# EAGLE design ws2812b-tree-test (EAGLE 8.4.0)
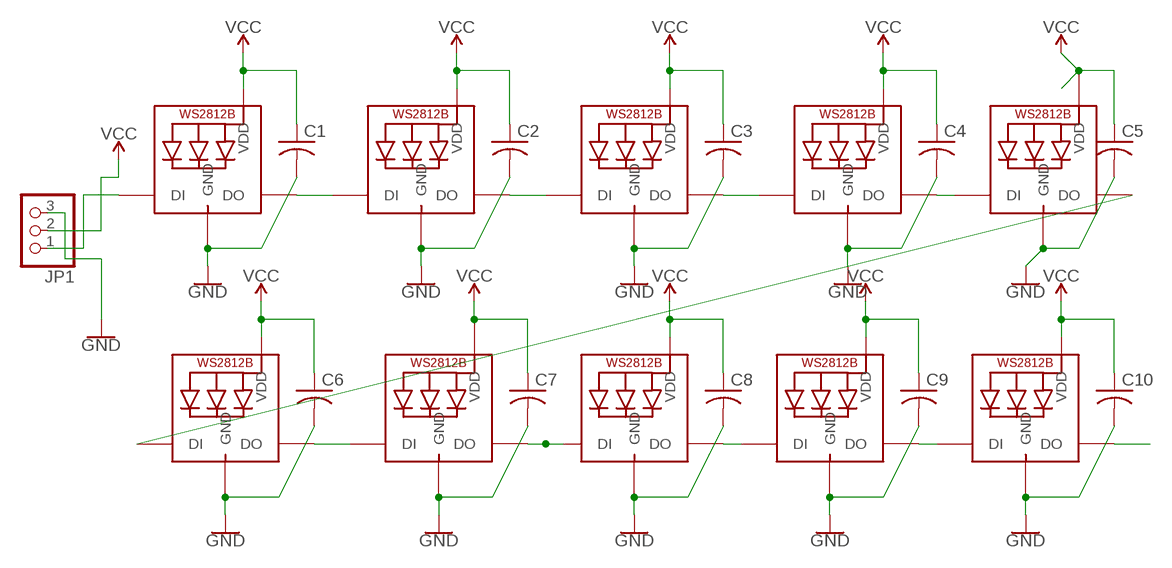
[diagram p0: schematic, sheet 1]

## Parts
C1  C-USC3216  [C3216]
C2  C-USC3216  [C3216]
C3  C-USC3216  [C3216]
C4  C-USC3216  [C3216]
C5  C-USC3216  [C3216]
C6  C-USC3216  [C3216]
C7  C-USC3216  [C3216]
C8  C-USC3216  [C3216]
C9  C-USC3216  [C3216]
C10  C-USC3216  [C3216]
JP1  PINHD-1X3  [1X03]
LED1  WS2812B5050  [WS2812B]
LED2  WS2812B5050  [WS2812B]
LED3  WS2812B5050  [WS2812B]
LED4  WS2812B5050  [WS2812B]
LED5  WS2812B5050  [WS2812B]
LED6  WS2812B5050  [WS2812B]
LED7  WS2812B5050  [WS2812B]
LED8  WS2812B5050  [WS2812B]
LED9  WS2812B5050  [WS2812B]
LED10  WS2812B5050  [WS2812B]

## Nets
GND: C1.2 C2.2 C3.2 C4.2 C5.2 C6.2 C7.2 C8.2 C9.2 C10.2 JP1.3 LED1.3-GND(GND) LED2.3-GND(GND) LED3.3-GND(GND) LED4.3-GND(GND) LED5.3-GND(GND) LED6.3-GND(GND) LED7.3-GND(GND) LED8.3-GND(GND) LED9.3-GND(GND) LED10.3-GND(GND)
N$1: LED2.2-DOUT(DO) LED3.4-DIN(DI)
N$2: LED1.2-DOUT(DO) LED2.4-DIN(DI)
N$3: LED3.2-DOUT(DO) LED4.4-DIN(DI)
N$4: LED4.2-DOUT(DO) LED5.4-DIN(DI)
N$5: LED6.2-DOUT(DO) LED7.4-DIN(DI)
N$6: LED5.2-DOUT(DO) LED6.4-DIN(DI)
N$7: LED7.2-DOUT(DO) LED8.4-DIN(DI)
N$8: LED8.2-DOUT(DO) LED9.4-DIN(DI)
N$9: LED9.2-DOUT(DO) LED10.4-DIN(DI)
N$10: LED10.2-DOUT(DO)
N$11: JP1.1 LED1.4-DIN(DI)
VCC: C1.1 C2.1 C3.1 C4.1 C5.1 C6.1 C7.1 C8.1 C9.1 C10.1 JP1.2 LED1.1-VDD(VDD) LED2.1-VDD(VDD) LED3.1-VDD(VDD) LED4.1-VDD(VDD) LED5.1-VDD(VDD) LED6.1-VDD(VDD) LED7.1-VDD(VDD) LED8.1-VDD(VDD) LED9.1-VDD(VDD) LED10.1-VDD(VDD)

## Library data of the parts
C1-C10 = adafruit:C-US: CAPACITOR, American symbol
JP1 = pinhead:PINHD-1X3: PIN HEADER
LED1-LED10 = adafruit:WS2812B

## Board
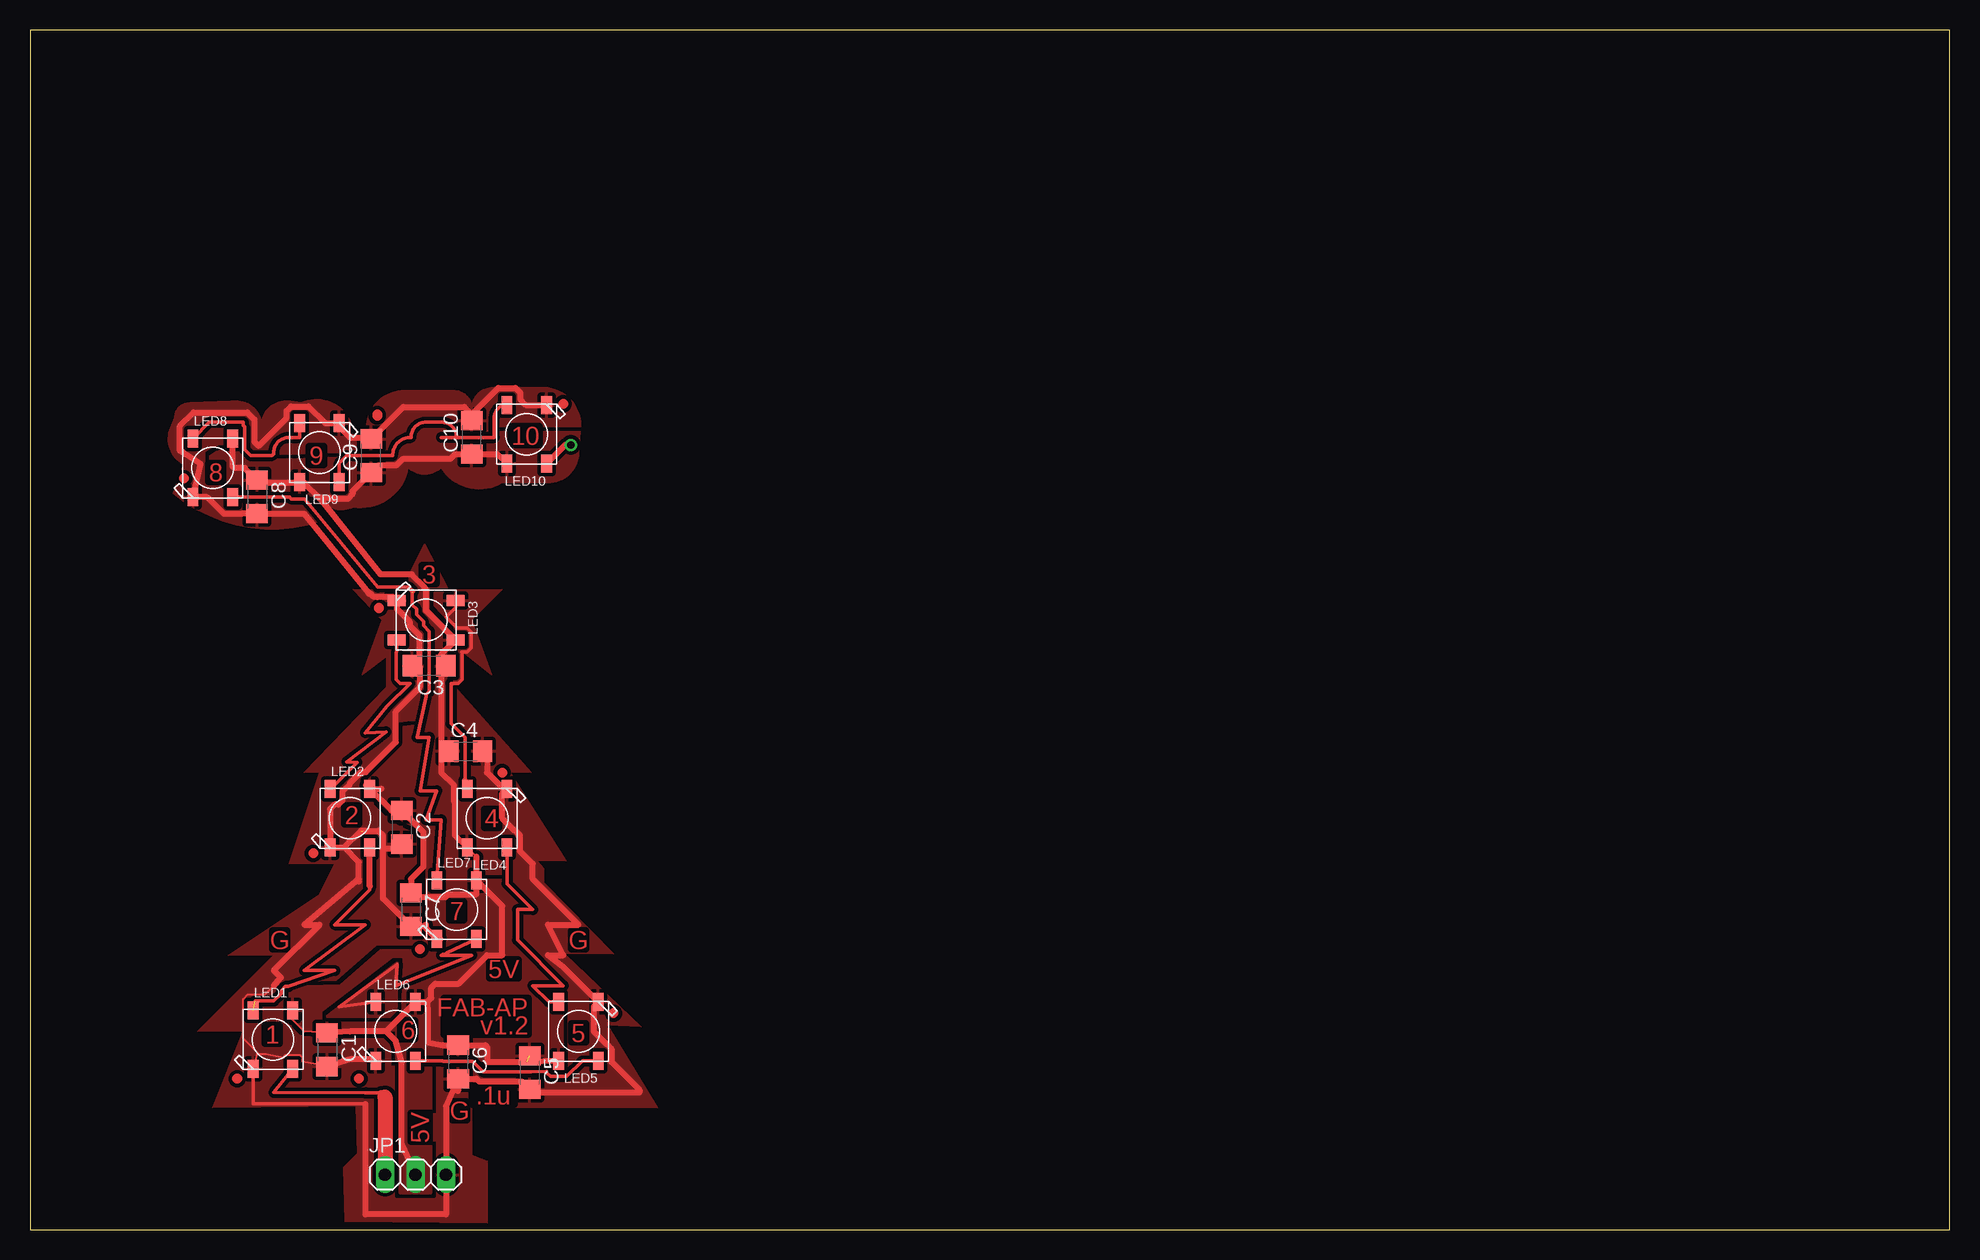
[diagram p1: board, top side]

Size 160 x 100 mm. Coordinates in mm from the lower left corner, seen from the top.
Outline: 0,0 160,0 160,100 0,100 0,0
Copper layers (1*16): Top 0.035mm / dielectric 1.5mm / Bottom 0.035mm
Design rules "default *": minimum track width 6mil, minimum drill 0.35mm, track to track 0.31mm, track to pad 0.31mm, pad to pad 0.31mm, via to via 0.31mm, smd to smd 0.31mm, copper to edge 0.31mm, drill to drill 6mil, minimum pad ring 10mil, minimum via ring 8mil, stop-mask expansion 4mil, vias tented up to drill 0mil, thermal gap 0.31mm

### Footprints (pad centres in the part's own frame; a part is rotated, then mirrored left to right if it is on the bottom)
C3216 = smd 1.6 x 1.8: 1 -1.4,0; 2 1.4,0
1X03 = drill 1.016 long: 1 -2.54,0; 2 0,0; 3 2.54,0
WS2812B = smd 1.5 x 0.9: 1-VDD 2.45,-1.65; 2-DOUT 2.45,1.65; 3-GND -2.45,1.65; 4-DIN -2.45,-1.65

### Placement (x,y rotation side)
C1  24.77,14.99 270 top
C2  30.99,33.53 270 top
C3  33.27,46.99 180 top
C4  36.32,39.88 0 top
C5  41.66,13.08 270 top
C6  35.69,13.97 270 top
C7  31.75,26.67 270 top
C8  18.92,61.09 270 top
C9  28.45,64.52 90 top
C10  36.83,66.04 90 top
JP1  32.13,4.57 0 top
LED1  20.25,15.84 90 top
LED2  26.67,34.29 90 top
LED3  33.02,50.8 0 top
LED4  38.1,34.29 270 top
LED5  45.72,16.51 270 top
LED6  30.48,16.51 90 top
LED7  35.56,26.67 90 top
LED8  15.24,63.5 90 top
LED9  24.13,64.77 270 top
LED10  41.4,66.29 270 top

### Tracks (layer width: path | path; a pad name or v marks a point on that pad's centre or on a via)
GND  (1 unrouted)
  Top 0.152: 18.94,14.77 LED1.3-GND | 20.32,20.32 19.59,19.59 18.15,19.59 17.76,19.2 17.76,15.94 18.94,14.77 | C1.2 22.74,14 22.74,14.3 22.51,14.53 21.29,14.53 21.09,14.33 19.66,14.62 19.09,14.62 18.94,14.77
  Top 0.305: LED1.3-GND 18.6,10.48 27.94,10.48
  Top 0.508: LED6.3-GND 28.36,14.22 26.8,14.22 C1.2 | 29.42,31.75 29.42,32.86 29.04,33.24 27.6,33.24 26.2,31.84 | 26.2,31.84 LED2.3-GND 25.02,35.05 25.39,35.43 25.7,35.43 26.03,35.76 26.03,36.52 26.67,37.16 26.67,37.22 27.6,38.14 27.98,38.14 30.48,40.64 30.48,43.18 32.47,45.17 32.47,46.99 | 34.2,24.22 LED7.3-GND 33.02,25.11 33.02,25.4 32.89,25.27 C7.2 29.42,27.6 29.42,31.75 | 30.57,52.07 LED3.3-GND | 19.05,59.68 22.85,59.68 28.26,53.01 28.4,53.01 28.59,52.78 28.63,52.78 28.66,52.75 28.96,52.72 30.3,52.72 LED3.3-GND | 19.05,59.68 17.65,59.68 17.61,59.65 16.17,59.65 14.77,61.05 LED8.3-GND 14.22,63.83 12.49,64.93 12.49,66.97 13.63,68.12 18.11,68.12 18.7,67.53 18.7,65.67 19.05,65.32 21.38,67.65 21.38,68.24 21.76,68.62 23.2,68.62 24.61,67.22 LED9.3-GND 25.78,66.93 26.67,66.04 28.32,66.04 C9.2 31.11,68.58 36.2,68.58 36.83,67.95 | C2.2 30.61,31.75 29.42,31.75 | C6.2 35.69,11.56 | C4.2 38.1,39.5 38.1,38.1 39.46,36.74 LED4.3-GND 39.37,36.36 39.37,34.29 40.42,33.24 40.47,33.24 40.85,32.86 40.85,31.54 41.91,30.48 41.91,29.21 45.72,25.4 43.18,25.4 44.45,22.86 43.18,22.86 44.45,21.88 LED5.3-GND 46.99,18.58 46.99,16.51 48.04,15.46 48.09,15.46 48.47,15.08 48.47,13.97 50.8,11.64 50.8,11.43 41.91,11.43 C5.2 41,12.34 40.83,12.34 37.45,12.34 37.43,12.36 37.22,12.57 C6.2 | 27.94,33.24 27.72,33.24 | 32.47,46.99 32.47,49.53 31.64,50.36 31.64,50.7 30.57,51.77 LED3.3-GND | C3.2 32.47,46.99 | C8.2 19.05,59.69 19.05,59.68 | 26.2,31.84 27.41,30.62 27.41,29.21 | 27.41,28.99 27.41,29.21 | 27.41,29.21 22.86,25.4 24.13,25.4 20.32,21.59 20.9,21.01 20.32,20.32 | C6.2 34.67,10.28 JP1.3 34.67,1.27 27.94,1.27 27.94,10.48
  Top 0.508: LED10.3-GND 41.33,68.74 40.86,69.22 40.86,69.77 40.47,70.15 39.03,70.15 36.83,67.95 | 36.83,67.95 C10.2
  pour Top (rank 6): 30.1,62.99 arc-90 11.94,61.34 12.83,63.75 arc-90 11.81,67.06 12.06,67.69 arc-90 13.34,68.96 16.76,69.09 arc-90 19.3,67.31 arc-90 21.72,69.09 22.61,68.96 arc-90 26.67,67.44 26.67,66.29 27.43,66.29 arc-90 27.94,66.8 28.07,66.8 arc-90 31.24,69.98 35.31,69.98 arc-90 36.83,68.45 arc-90 38.61,70.23 43.18,70.23 arc-90 45.85,66.42 33.78,66.55
  pour Top (rank 5): 26.29,0.64 26.16,5.21 27.3,6.35 27.18,10.29 15.24,10.16 17.78,16.51 13.97,16.51 20.32,22.86 16.51,22.86 24.13,27.94 25.4,30.48 21.59,30.48 24.13,38.1 22.86,38.1 29.72,45.21 29.72,47.75 27.69,46.23 29.34,50.8 26.92,53.34 31.75,53.47 32,51.69 33.15,49.78 33.4,47.37 33.15,44.96 35.31,44.83 35.31,45.34 41.78,38.1 40.01,38.1 44.7,30.73 42.29,30.73 42.8,30.1 42.8,28.96 48.64,22.99 44.58,22.99 50.93,16.89 48.13,17.02 52.32,10.16 36.83,10.16 36.83,6.22 38.1,5.71 38.1,0.51
  pour Top (rank 2): 27.94,38.1 25.4,38.1 30.48,43.18 30.48,40.64
N$1
  Top 0.305: LED3.4-DIN 30.57,48.17 30.52,48.12 30.52,45.86 30.84,45.54 31.67,45.54 29.77,43.64 | 29.77,43.64 29.67,43.54 | LED2.2-DOUT 25.05,36.74 27.27,38.95 26.42,38.99 29.67,41.49 27.94,41.4 29.77,43.64
N$2  (1 unrouted)
  Top 0.305: 18.76,19.05 20.32,19.05 20.97,19.7 20.97,19.94 21.29,20.26 21.53,20.26 25.4,21.59 22.86,21.59 27.94,25.4 25.4,25.4 28.32,28.32 28.32,28.61
  Top 0.508: 28.32,28.61 LED2.4-DIN
N$3
  Top 0.305: 36.25,36.94 36.25,38.73 36.27,38.75 36.27,41.01 35.1,42.19 35.1,45.54 35.7,45.54 36.03,45.86 36.03,48.12 | 36.03,48.12 36,48.15 | LED3.2-DOUT 35.47,51.85 34.69,51.07 35.61,50.15 36.45,50.15 36.77,49.83 36.77,48.47 36.45,48.15 36.05,48.15 36.03,48.12
  Top 0.508: 36.25,37.42 36.25,36.94 LED4.4-DIN
  pour Top (rank 5): 33.4,53.34 39.37,53.34 36.83,50.8 38.48,46.23 36.07,48.13 36.07,45.85 35.69,45.47 35.31,45.34 35.31,49.66 33.4,51.69
N$4
  Top 0.305: LED4.2-DOUT 39.75,28.83 41.91,26.67 40.64,26.67 40.64,24.13 44.45,20.32 41.91,20.32 43.27,18.96 LED5.4-DIN
N$5
  Top 0.2: 29.12,18.96 LED6.2-DOUT
  Top 0.305: LED7.4-DIN 34.74,23.07 34.59,22.92 34.41,22.92 34.29,22.86 36.83,22.86 30.48,20.32 30.61,22.1 25.78,18.54 LED6.2-DOUT
  pour Top: 30.48,17.78 24.77,17.78 30.61,22.23
N$6
  Top 0.305: LED6.4-DIN 34.39,14.06 34.43,14.02 36.91,14.02 37.77,13.16 41.12,13.16 41.13,13.15 41.45,13.16 41.77,13.16 43.07,13.21 43.07,13.08 43.39,12.76 44.75,12.76 46.05,14.06 LED5.2-DOUT
N$7  (1 unrouted)
  Top 0.305: LED8.4-DIN 21.62,61.05 21.76,60.92 22.9,60.92 29,53.55 31.59,53.55 31.97,53.17 | 31.78,53.37 31.78,53.22 31.87,53.13 31.87,52.07 32.21,51.73 32.21,51.27 32.81,50.67 32.81,50.34 33.28,49.86 33.28,44.84 33.03,44.59 33.02,44.45 32.26,41.02 33.27,41.02 32.51,36.58 33.91,36.58 33.02,34.16 34.29,34.16 LED7.2-DOUT
N$8
  Top 0.305: LED8.2-DOUT 14.95,67.31 17.78,67.31 17.78,67.04 17.89,66.93 17.89,65.04 18.41,64.52 20.07,64.52 arc90 20.32,64.77 arc-90 21.59,66.04 22.48,66.04 LED9.4-DIN
N$9
  Top 0.305: 35.56,66.04 34.29,66.04 | 35.56,66.04 38.7,66.04 38.7,67.69 arc-90 LED10.4-DIN | LED9.2-DOUT 25.78,63.88 26.42,64.52 30.23,64.52 arc-90 31.75,66.04 arc-90 33.02,67.31 34.29,67.31 arc-90 35.56,66.04
N$10  (via drill 0.6)
  Top 0.508: LED10.2-DOUT 44.61,65.41 v45.09,65.41 45.21,65.41
N$11
  Top 0.305: 28.11,11.39 27.94,11.39 | LED1.4-DIN 20.32,11.43 27.94,11.39 | 27.94,11.39 29.25,11.39
  Top 0.508: 29.25,11.39 29.59,11.05
  Top 1.27: 29.59,11.05 JP1.1
VCC  (1 unrouted)
  Top 0.152: C1.1 22.86,16.51 21.59,17.78 LED1.1-VDD
  Top 0.2: 32.22,19.05 LED6.1-VDD | 35.18,49.15 LED3.1-VDD | 37.21,31.08 LED4.1-VDD
  Top 0.508: 29.68,16.51 26.67,16.51 C1.1 | 29.68,16.51 LED6.1-VDD 33.11,18.96 | LED5.1-VDD 41.44,13.97 38.1,13.97 38.1,15.24 37.97,15.37 C6.1 34.42,15.37 33.15,15.62 33.15,18.16 33.11,18.96 | LED7.1-VDD 37.21,31.08 | LED7.1-VDD 39.37,26.96 39.37,22.86 38.1,22.86 35.73,20.5 33.77,20.5 33.44,20.16 33.44,19.29 33.11,18.96 | 28.02,37.04 LED2.1-VDD | LED4.1-VDD 35.41,32.88 35.41,35.65 35.35,35.72 35.35,37.04 34.29,38.1 34.29,39.37 | LED2.1-VDD 29.3,36.74 | 34.29,46.99 34.29,39.37 | 34.29,46.99 34.29,47.97 LED3.1-VDD 33.02,51.6 33.02,53.34 32.88,53.48 32.88,53.55 31.82,54.61 29.22,54.61 24.14,60.96 | LED7.1-VDD 37.21,27.94 34.85,27.94 34.63,27.72 32.1,27.72 C7.1 31.75,29.21 32.81,30.27 32.81,33.11 C2.1 30.13,34.93 LED2.1-VDD | C4.1 34.8,39.88 34.29,39.37 | C3.1 34.29,46.99 | 24.13,60.96 24.14,60.96 | LED8.1-VDD 16.89,63.63 17.02,63.5 17.91,63.5 C8.1 19.18,62.36 19.05,62.23 22.39,62.23 LED9.1-VDD 22.57,62.23 22.87,62.23 24.14,60.96 | 28.45,62.99 C9.1 | JP1.2 30.99,7.11 30.99,13.97 30.48,15.71 29.68,16.51 | LED10.1-VDD 38.96,64.64 C10.1 35.43,64.64 35.05,64.26 31.11,64.26 30.56,63.71 29.04,63.71 C9.1 | C9.1 26.88,61.55 26.88,61.3 26.5,60.92 25.06,60.92 25.02,60.96 24.14,60.96
  pour Top (rank 4): 14.99,64.52 arc-90 18.54,64.26 22.48,64.26 23.5,64.39 29.34,64.39 arc90 30.73,64.77 30.73,65.79 32.38,67.44 34.8,67.44 35.69,66.55 45.85,66.55 45.72,64.77 arc-90 43.18,62.23 39.37,62.23 arc-90 34.29,63.5 arc-90 31.5,63.5 arc-90 26.92,60.2 arc-90 24.13,61.09 14.99,61.09
  pour Top (rank 3): 30.48,41.91 32.38,42.16 33.27,45.21 33.27,47.37 34.42,47.62 34.54,42.67 36.83,40.64 36.83,29.21 39.37,29.21 41.91,26.67 40.64,26.67 40.64,24.13 44.45,20.32 44.45,13.97 30.48,13.97 30.48,16.51 22.86,16.51 21.59,17.78 21.59,20.32 25.91,20.45 29.21,23.37 33.02,23.37 33.02,33.02 30.48,34.29 27.3,37.47 30.48,40.64
  pour Top (rank 4): 31.62,54.61 32.89,57.15 34.8,53.47 33.27,53.47 33.27,51.69 35.31,49.53 35.31,41.91 35.56,41.02 32.38,41.02 33.53,45.47 33.53,49.91 32,51.94 31.62,53.59
  pour Top (isolate 0.254, no thermals): 30.86,14.1 33.4,14.1 33.4,3.05 30.86,3.05
(copper drawn outside any net)
  shapes: Top circle x11

### Text on the board
Top: 10 | 9 | 8 | 3 | 2 | 4 | 7 | G | G | 5V | 6 | 1 | FAB-AP / v1.2 | 5 | .1u | G | 5V